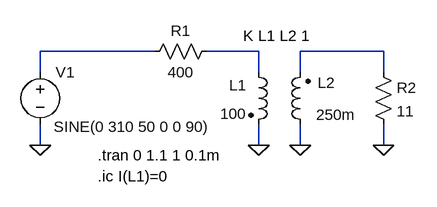
[diagram p0: schematic Trans1.asc]
Trans1.asc, the LTspice schematic file:
Version 4
SHEET 1 880 680
WIRE 48 64 -128 64
WIRE 208 64 128 64
WIRE 400 64 272 64
WIRE -128 96 -128 64
WIRE 208 96 208 64
WIRE 272 96 272 64
WIRE 400 96 400 64
WIRE -128 208 -128 176
WIRE 208 208 208 176
WIRE 272 208 272 176
WIRE 400 208 400 176
FLAG -128 208 0
FLAG 208 208 0
FLAG 272 208 0
FLAG 400 208 0
SYMBOL ind2 192 80 R0
WINDOW 0 -29 36 Left 0
WINDOW 3 -43 80 Left 0
SYMATTR InstName L1
SYMATTR Value 100
SYMATTR Type ind
SYMBOL ind2 288 192 R180
WINDOW 0 -38 80 Left 0
WINDOW 3 -69 31 Left 0
SYMATTR InstName L2
SYMATTR Value 250m
SYMATTR Type ind
SYMBOL res 144 48 R90
WINDOW 0 0 56 VBottom 0
WINDOW 3 32 56 VTop 0
SYMATTR InstName R1
SYMATTR Value 400
SYMBOL res 384 80 R0
SYMATTR InstName R2
SYMATTR Value 11
SYMBOL voltage -128 80 R0
WINDOW 3 21 100 Left 0
WINDOW 123 0 0 Left 0
WINDOW 39 0 0 Left 0
SYMATTR Value SINE(0 310 50 0 0 90)
SYMATTR InstName V1
TEXT -40 224 Left 0 !.tran 0 1.1 1 0.1m
TEXT 184 40 Left 0 !K L1 L2 1
TEXT -40 256 Left 0 !.ic I(L1)=0

The netlist it stands for:
* Trans1.asc
L1 N002 0 100
L2 0 N003 250m
R1 N002 N001 400
R2 N003 0 11
V1 N001 0 SINE(0 310 50 0 0 90)
.tran 0 1.1 1 0.1m
K L1 L2 1
.ic I(L1)=0
.backanno
.end